# Altium schematic sheet Auto_Switch.SchDoc
size A; SheetNumber: 1; SheetTotal: 1; SPICEModelCacheZGWVIQHB: <root> / <DocumentId>ZGWVIQHB</DocumentId> / </root>
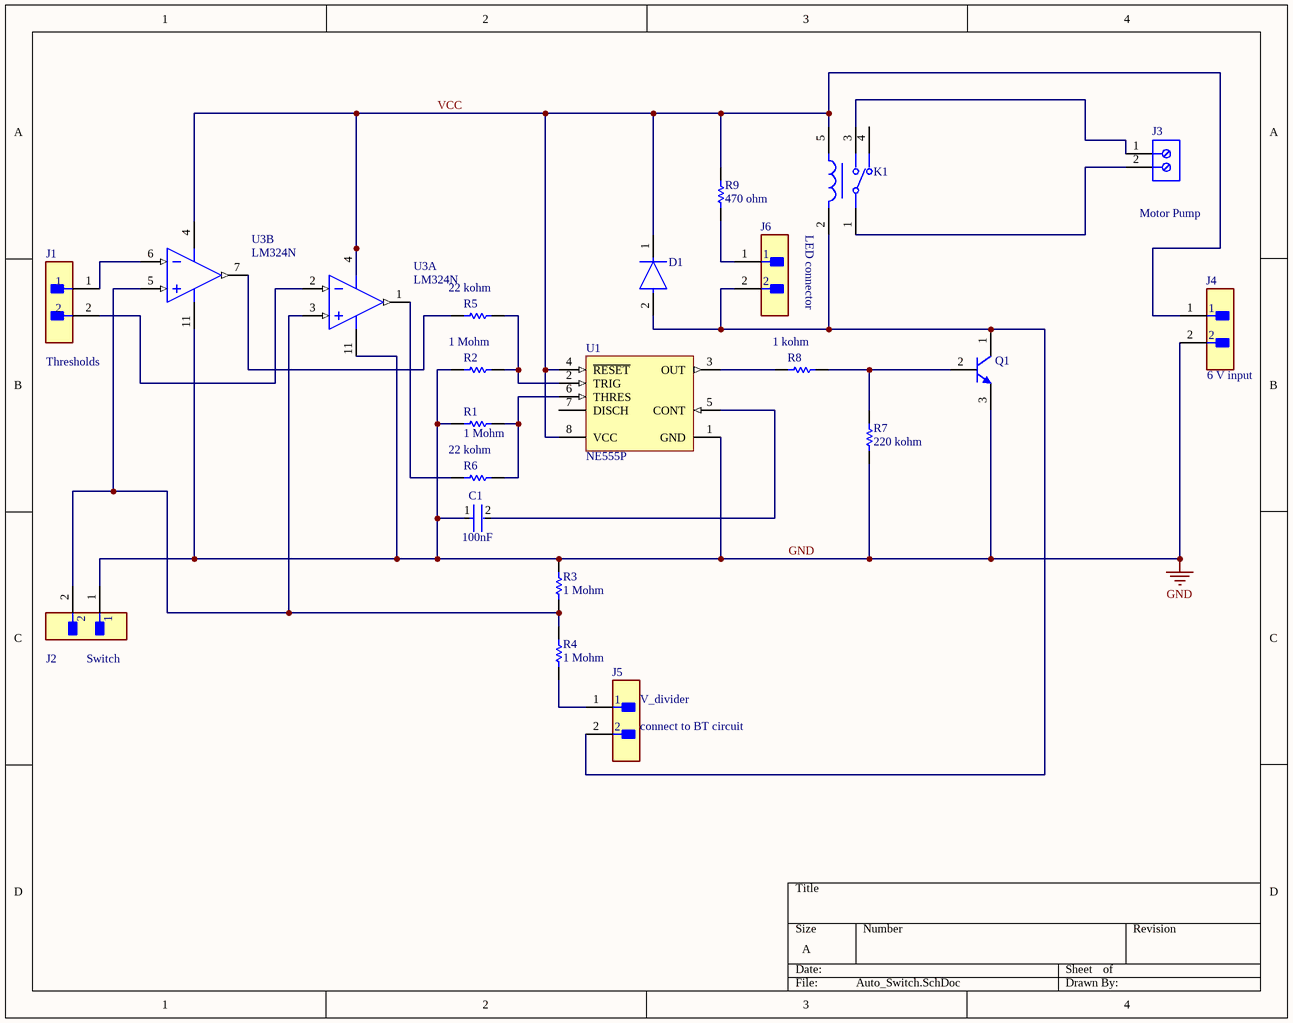
[diagram p0: Auto_Switch.SchDoc]

## Parts
C1  Capacitance: 100nF  [FP-RDE2M1-MFG]  (hidden comment: RDER72E104K2K1H03B)
D1  1N4007-E3/54  [FP-1N4007-MFG]  (value not drawn)
J1  TSW-102-07-L-S  [FP-TSW-102-07-L-S-MFG]  (value not drawn)
J2  TSW-102-07-L-S  [FP-TSW-102-07-L-S-MFG]  (value not drawn)
J3  691101710002  [691101710002]  (value not drawn)
J4  TSW-102-07-L-S  [FP-TSW-102-07-L-S-MFG]  (value not drawn)
J5  TSW-102-07-L-S  [FP-TSW-102-07-L-S-MFG]  (value not drawn)
J6  TSW-102-07-L-S  [FP-TSW-102-07-L-S-MFG]  (value not drawn)
K1  G5LE-14-DC5  [FP-G5LE-14-DC5-MFG]  (value not drawn)
Q1  BC547B  [ONSC-TO-92-3-29-11]  (value not drawn)
R1  Resistance: 1 Mohm  [RESA60-630X240]  (hidden comment: MFR-25FBF52-1M)
R2  Resistance: 1 Mohm  [RESA60-630X240]  (hidden comment: MFR-25FBF52-1M)
R3  Resistance: 1 Mohm  [RESA60-630X240]  (hidden comment: MFR-25FBF52-1M)
R4  Resistance: 1 Mohm  [RESA60-630X240]  (hidden comment: MFR-25FBF52-1M)
R5  Resistance: 22 kohm  [RESA60-630X240]  (hidden comment: MFR-25FBF52-1M)
R6  Resistance: 22 kohm  [RESA60-630X240]  (hidden comment: MFR-25FBF52-1M)
R7  Resistance: 220 kohm  [RESA60-630X240]  (hidden comment: MFR-25FBF52-1M)
R8  Resistance: 1 kohm  [RESA60-630X240]  (hidden comment: MFR-25FBF52-1M)
R9  Resistance: 470 ohm  [RESA60-630X240]  (hidden comment: MFR-25FBF52-1M)
U1  NE555P  [P0008A]
U3  LM324N  [N0014A]  (parts A,B of 4)

## Nets
GND: C1.1 J2.1 J4.2 Q1.3(E) R1.2 R2.1 R3.2 R7.1 U1.1(GND) U3.11(GND)
VCC: D1.1(C) J4.1 K1.5 R9.2 U1.4(~{RESET}) U1.8(VCC) U3.4(V+)
NetC1_2: C1.2 U1.5(CONT)
NetD1_2: D1.2(A) J5.2 J6.2 K1.2 Q1.1(C)
NetJ1_1: J1.1 U3.6(IN2-)
NetJ1_2: J1.2 U3.2(IN1-)
NetJ2_2: J2.2 R3.1 R4.2 U3.3(IN1+) U3.5(IN2+)
NetJ3_1: J3.1 K1.3
NetJ3_2: J3.2 K1.1
NetJ5_1: J5.1 R4.1
NetJ6_1: J6.1 R9.1
NetQ1_2: Q1.2(B) R7.2 R8.2
NetR1_1: R1.1 R6.2 U1.6(THRES)
NetR2_2: R2.2 R5.2 U1.2(TRIG)
NetR5_1: R5.1 U3.7(OUT2)
NetR6_1: R6.1 U3.1(OUT1)
NetR8_1: R8.1 U1.3(OUT)

Not connected (* = marked no-connect by the designer): K1 4; U1 7(DISCH)

## Notes on the sheet
- LED connector
- (near J3) Motor Pump
- (near J1) Thresholds
- (near J4) 6 V input
- (near J2) Switch
- (near J5) V_divider
- (near J5) connect to BT circuit

## Library data of the parts
C1 = CMP-06035-020184-1: Ceramic Capacitor 100nF ±10% 250V X7R Radial; Lead/Base Style: Kinked; Lead Diameter: 0.5mm; Lead Pitch: 0.197inch; Dielectric: X7R; Mount: Through Hole; Resistor Type: Ceramic; Height: 4mm; Width: 0.124inch; Length: 5.5mm; Case/Package: Radial; Packaging: Bulk; Max Operating Temperature: 125°C; Voltage Rating (DC): 250V; Package Quantity: 500; Min Operating Temperature: -55°C; Voltage Rating: 250V; Termination: Radial; Tolerance: 10%; Height - Seated (Max): 0.236inch; Lead Free: Lead Free
D1 = CMP-02540-000046-1: DIODE GEN PURP 1KV 1A DO204AL; Manufacturer: Vishay; Value: 15pF; Max Junction Temp: +150°C; Max Surge Forward Current: 30A; Max Repetitive Reverse Voltage: 1000V; Peak Reverse Current: 30uA; Octopart: https://octopart.com/1n4007-e3%2F54-vishay-39548207; Digikey Description: DIODE GEN PURP 1KV 1A DO204AL; Category: Diode; Mouser Description: Rectifiers Vr/1000V Io/1A; Automotive: No; Package: 1N4007; Device Class L3: Rectifier Diodes; Temperature Range High: +150°C; Capacitance: 15pF; Ipc Land Pattern Name: DIOPA1088W105L520D270; Lead Free: Yes; ComponentLink2Description: Datasheet; Forward Current: 1A; Device Class L1: Discrete Semiconductors; ComponentLink2URL: http://www.vishay.com/docs/88503/1n4001.pdf; Temperature Range Low: -50°C; Height: 2.7mm; RoHS: TRUE; Temperature: -50°C to +150°C; Device Class L2: Diodes; Manufacturer Part Number: 1N4007-E3/54
J1 J2 J4-J6 = CMP-02766-001428-1: CONN HEADER VERT 2POS 2.54MM; Voltage Rating: 550V; Current Rating: 7.6A; Gender: Male; Number of Contacts: 2; Connector Type: Male Pin; Radiation Hardening: No; Orientation: Straight; Contact Plating: Gold; Max Operating Temperature: 125°C; Mount: Through Hole; Package Quantity: 1; Number of Rows: 1; Housing Material: Polyester; RoHS Compliant: Yes; Length: 5.08mm; Max Voltage Rating (AC): 550V; Pitch: 2.54mm; Packaging: Bulk; Depth: 2.54mm; Termination: Solder; Min Operating Temperature: -55°C; Housing Color: Black; Lead Free: Lead Free; Color: Black; Number of Positions: 2; Width: 2.54mm; Max Current Rating: 7.6A; REACH SVHC: No SVHC; Contact Material: Bronze; Contact Mating Length: 0.23inch; Series: TSW; Contact Type: Male Pin
J3 = CMP-1502-03256-1: Series 101 - 5.00 mm Horizontal Entry Modular with Pressure Clamp WR-TBL, 2 pin; Manufacturer: Wurth Elektronik; Pin Number: 2; Pitch: 5.00mm; Package Reference: 691101710002; Part Number: 691101710002; Publisher: WurthElektronik; Datasheet URL: http://katalog.we-online.de/em/datasheet/6911017100xx.pdf; Packaging: Box; Operating Temperature: -40to105degC; Manufacturer URL: http://www.we-online.de; Mounting Technology: THT
K1 = CMP-08822-000008-1: RELAY GEN PURPOSE SPDT 10A 5V; Manufacturer: Omron; Number Of Contacts: 1; Coil Type: Non-Latching; Coil Current: 79.4mA; Coil Power: 400mW; Coil Resistance: 63Ω; Standoff Height: 0.5mm; Throw Configuration: SPDT; Ambient Temperature Range Low: -25°C; Package: 0; Device Class L2: Relays; Temperature Range High: +85°C; ComponentLink2Description: Datasheet; Octopart: https://octopart.com/g5le-14-dc5-omron-28829; Coil Voltage: 5V; Lead Free: Yes; Digikey Description: RELAY GEN PURPOSE SPDT 10A 5V; Device Class L1: Electromechanical; Device Class L3: Power Relays; ComponentLink2URL: https://omronfs.omron.com/en_US/ecb/products/pdf/en-g5le.pdf; Temperature: -25°C to +85°C; Ambient Temperature Range High: +85°C; RoHS: TRUE; Automotive: No; Height: 19mm; Category: Relay; Manufacturer Part Number: G5LE-14-DC5; Mouser Description: General Purpose Relays Power PCB Relay SPDT Sealed 5VDC; Current Rating: 10A; Switching Current: 10A; Temperature Range Low: -25°C
Q1 = CMP-1048-01467-1: Amplifier Transistor, NPN Silicon, 3-Pin TO-92, Bulk Box; Manufacturer: On Semiconductor; IC Continuous (A): 0.1; fT Min (MHz): 150; DatasheetVersion: Rev. 7; ComponentLink1URL: http://www.onsemi.com/; Polarity: NPN; RoHS: FALSE; ComponentLink1Description: Manufacturer URL; Packing: Bulk Box; PackageDescription: 3-Pin Transistor Outline, Body 4.825 x 3.685 mm, Pitch 1.27 mm; ComponentLink3URL: http://www.onsemi.cn/pub_link/Collateral/2N6426-D.PDF; ComponentLink2Description: Datasheet; PackageVersion: Rev. AM; PackageReference: TO-92-3-29-11_AM_SL; ComponentLink3Description: Package Specification; Mounting Technology: Through Hole; PartNumber: BC547B; ComponentLink2URL: http://www.onsemi.com/pub_link/Collateral/BC546-D.PDF
R1-R9 = CMP-1659-00070-1: Axial Resistor, 1 MOhm, +/- 1%, 250 mW, -55 to 155 degC, 2-Pin THD, RoHS, Bulk; Power Rating: 250 mW; Voltage Rating: 250 V; ComponentLink1Description: Manufacturer URL; PackageReference: MFR-25; ComponentLink2Description: Datasheet; ComponentLink2URL: http://www.yageo.com/documents/recent/Yageo%20LR_MFR_2013.pdf; Tolerance: 1%; DatasheetVersion: Apr-13; Package Quantity: 200; Packaging: Bulk; Case\Package: Axial; RoHSCompliant: true; ComponentLink1URL: http://www.yageo.com/; Length: 0.248 inch; Min Operating Temperature: -55 degC; Mount: Through Hole; PackageDescription: 2-Pin Axial Lead, Dia 2.4 mm, Body Length 6.3 mm; Max Operating Temperature: 155 degC
U1 = CMP-2000-04954-1: Precision Timer, 4.5 to 16 V, 0 to 70 degC, 8-Pin DIP, Pb-Free, Tube; Manufacturer: TexasInstruments; Maximum High Level Output Current: -200mA; Number of Internal Timers: 1; Operating Supply Voltage: 5; Maximum Low Level Output Current: 200mA; Rad Hard: No; Packaging: Rail/Tube; Manufacturer URL: http://www.ti.com/; Package Reference: P8; Package Description: 8-Pin Double In-line Package, Body 9.59 x 6.35 mm, Pitch 2.54 mm; Package URL: http://www.ti.com/lit/ml/mpdi001b/mpdi001b.pdf; Type: Standard; Datasheet URL: http://www.ti.com/general/docs/lit/getliterature.tsp?genericPartNumber=NE555&fileType=pdf; Category: Timer; Package: 8PDIP; Datasheet Version: Rev. I, 09/2014
U3 = CMP-0055-00082-3: Low Power Quad Operational Amplifier, 14-pin MDIP; Manufacturer: Texas Instruments; CompType: Amplifiers; PowerWise: N; PackageTopMarking: NSUZXYYTTE#*LM324N; PackageDescription: MDIP, .750 x .250 x.130in, 14 Lead, .100in Pitch; Package Reference: N0014A; RoHS: N; Code_JEDEC: MS-001-AA; ComponentLink1URL: http://www.ti.com/general/docs/lit/getliterature.tsp?genericPartNumber=LM324&fileType=pdf; ComponentLink1Description: Datasheet URL; PinCount: 14